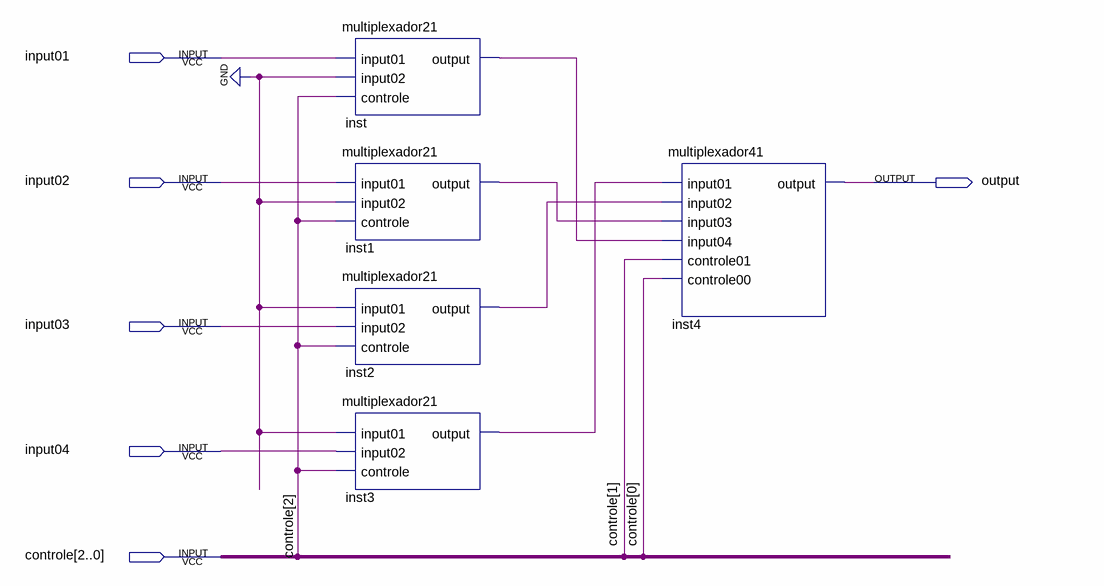
[diagram p0: schematic sheet]
// Quartus schematic muxComparadores.bdf as structural Verilog: 5 symbols, 6 pins
module muxComparadores (
  input  input01,
  input  input02,
  input  input03,
  input  input04,
  input  [2:0] controle,
  output \output 
);

  wire inst1_output, inst2_output, inst3_output, inst_output;

  multiplexador21 inst (.input01(input01), .input02(1'b0), .controle(controle[2]), .\output (inst_output));
  multiplexador21 inst1 (.input01(input02), .input02(1'b0), .controle(controle[2]), .\output (inst1_output));
  multiplexador21 inst2 (.input01(1'b0), .input02(input03), .controle(controle[2]), .\output (inst2_output));
  multiplexador21 inst3 (.input01(1'b0), .input02(input04), .controle(controle[2]), .\output (inst3_output));
  multiplexador41 inst4 (
    .input01(inst3_output), .input02(inst2_output), .input03(inst1_output), .input04(inst_output),
    .controle01(controle[1]), .controle00(controle[0]), .\output (\output ));
endmodule
